# Altium schematic sheet SheetPower.SchDoc
size A4; DocumentNumber: 2; SheetNumber: 2; SheetTotal: 5
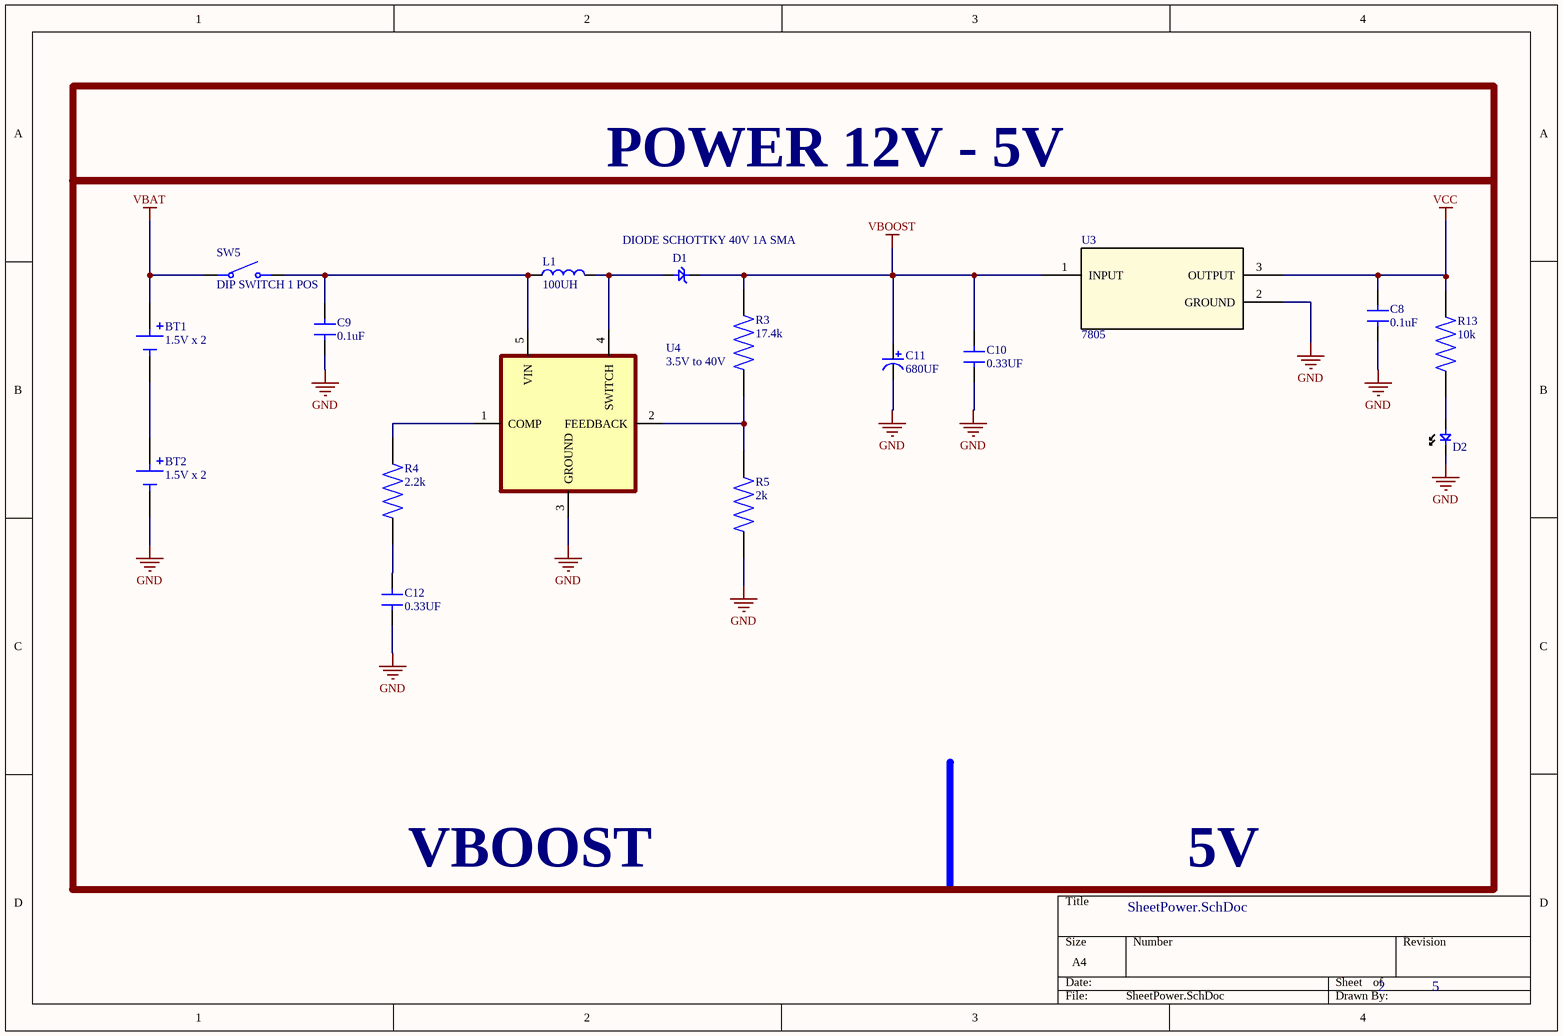
[diagram p0: SheetPower.SchDoc]

## Parts
BT1  1.5V x 2  [AAA battery holder]
BT2  1.5V x 2  [AAA battery holder]
C8  0.1uF  [CAP104 0.1UF 50V]
C9  0.1uF  [CAP104 0.1UF 50V]
C10  0.33UF  [CAP 0.33UF]
C11  680UF  [680uf 35v]
C12  0.33UF  [CAP 0.33UF]
D1  DIODE SCHOTTKY 40V 1A SMA  [DIODE SCHOTTKY 40V 1A SMA]
D2  LED SM 0805 2V 100MCD RED  [LED 0805]  (value not drawn)
L1  100UH  [FIXED IND 100UH 2.5A 135MOHM SMD]
R3  17.4k  [RESC2012X60N]
R4  2.2k  [RESC2012X60N]
R5  2k  [RESC2012X60N]
R13  10k  [RC0805 10K OHM 1% 1/8W]
SW5  DIP SWITCH 1 POS  [DIP SWITCH 1 POS]
U3  7805  [DPAK-3_ONS-M]
U4  3.5V to 40V  [LM2577S-ADJ]

## Nets
GND: BT2.2 C8.1 C9.1 C10.1 C11.2 C12.1 D2.K R5.1 U3.2(GROUND) U4.3(GROUND)
VBAT: BT1.1 SW5.1
VBOOST: C10.2 C11.1 D1.2 R3.2 U3.1(INPUT)
VCC: C8.2 R13.2 U3.3(OUTPUT)
NetBT1_2: BT1.2 BT2.1
NetC9_2: C9.2 L1.1 SW5.2 U4.5(VIN)
NetC12_2: C12.2 R4.1
NetD1_1: D1.1 L1.2 U4.4(SWITCH)
NetD2_A: D2.A R13.1
NetR3_1: R3.1 R5.2 U4.2(FEEDBACK)
NetR4_2: R4.2 U4.1(COMP)

## Notes on the sheet
- POWER 12V - 5V
- VBOOST
- 5V

## Library data of the parts
BT1 BT2 = BC2AAAL: 2 AAA Battery Holder; Package: None; Price: None; Value: *; MP: BC2AAAL; Availability: Unavailable
C8 C9 = C0805C104K5RACTU: Cap Ceramic 0.1uF 50V X7R 10% SMD 2.0 x 1.2 mm 125 C Paper T/R; Manufacturer: KEMET; Capacitance: 100nF; Voltage: 500V; Supplier 1: Digi-Key; Manufacturer Part Number: C0805C104K5RACTU; Stock 1: 2487008; Pricing 1: 1 = 0.16000, 10 = 0.11500, 50 = 0.06540, 100 = 0.05420, 500 = 0.03802, 1000 = 0.03147 (USD); RoHS: Yes; Mount: Surface Mount,PCB; Case/Package: 0805; Number of Pins: 2; Dielectric Material: Ceramic; Case Code (Imperial): 0805; Case Code (Metric): 2012; Contact Plating: Tin,Matte; Min Operating Temperature: -55°C; Max Operating Temperature: 125°C; Tolerance: 10%; Packaging: Tape and Reel; Voltage Rating (DC): 50V; Dielectric: X7R; Termination: SMD/SMT; Package Quantity: 4000; Voltage Rating: 50V; Length: 2mm; Height: 0.9mm; Width: 1.2mm; Lead Pitch: 0.75mm; Depth: 1.25mm; Thickness: 0.035inch; Radiation Hardening: No; REACH SVHC: No SVHC; ComponentLink1URL: https://datasheet.ciiva.com/14589/70095383-14589048.pdf?src-supplier=Allied+Electronics; ComponentLink1Description: https://datasheet.ciiva.com/14589/70095383-14589048.pdf?src-supplier=Allied+Electronics; ComponentLink2URL: https://datasheet.ciiva.com/28682/1851736-28682232.pdf?src-supplier=Element14; ComponentLink2Description: https://datasheet.ciiva.com/28682/1851736-28682232.pdf?src-supplier=Element14; ComponentLink3URL: https://datasheet.ciiva.com/32431/slceramic-chip-condensers-e-32431755.pdf?src-supplier=Distrelec; ComponentLink3Description: https://datasheet.ciiva.com/32431/slceramic-chip-condensers-e-32431755.pdf?src-supplier=Distrelec; ComponentLink4URL: https://datasheet.ciiva.com/18410/70095383-18410815.pdf?src-supplier=Allied+Electronics; ComponentLink4Description: https://datasheet.ciiva.com/18410/70095383-18410815.pdf?src-supplier=Allied+Electronics; Supplier Part Number 1: 399-1170-1-ND
C10 C12 = C0805C334M4VACTU: Multilayer Ceramic Capacitors MLCC - SMD/SMT 16volts 0.33uF Y5V 20%; Manufacturer: KEMET; Capacitance: 330nF; Voltage Rating: 16V; Dissipation Factor: 7%; Supplier 1: Digi-Key; Manufacturer Part Number: C0805C334M4VACTU; Stock 1: 0; Pricing 1: 5000 = 0.06512 (USD); RoHS: Yes; Mount: Surface Mount; Case/Package: 0805; Case Code (Metric): 2012; Case Code (Imperial): 0805; Dielectric Material: Ceramic; Min Operating Temperature: -30°C; Max Operating Temperature: 85°C; Tolerance: 20%; Package Quantity: 4000; Packaging: Tape and Reel; Voltage Rating (DC): 16V; Dielectric: Y5V; Termination: SMD/SMT; Resistor Type: Ceramic; Series: C; Construction: Flat; Length: 2mm; Width: 0.049inch; Height: 0.78mm; Thickness: 0.043inch; Lead Pitch: 0.75mm; Depth: 1.25mm; Lead Free: Lead Free; RoHS Compliant: Yes; ComponentLink1URL: http://www.mouser.com/ds/2/212/KEM_C1005_Y5V_SMD-1101305.pdf?src-supplier=Mouser; ComponentLink1Description: http://www.mouser.com/ds/2/212/KEM_C1005_Y5V_SMD-1101305.pdf?src-supplier=Mouser; ComponentLink2URL: https://search.kemet.com/component-edge/download/datasheet/C0805C334M4VACTU.pdf?src-supplier=Digi-Key; ComponentLink2Description: https://search.kemet.com/component-edge/download/datasheet/C0805C334M4VACTU.pdf?src-supplier=Digi-Key; Supplier Part Number 1: C0805C334M4VACTU-ND
C11 = UCX1V681MNS1MS: Cap Alum 680UF 20% 35V SMD; Manufacturer: Nichicon; ESR (Equivalent Series Resistance): 70mR; Ripple Current: 750mA; Life (Hours): 2000Hour; Supplier 1: Digi-Key; Manufacturer Part Number: UCX1V681MNS1MS; Stock 1: 23; Pricing 1: 1 = 2.25000, 10 = 1.81900, 50 = 1.58760, 100 = 1.38910 (USD); RoHS: Yes; Mount: Surface Mount; Case/Package: Radial; Min Operating Temperature: -40°C; Max Operating Temperature: 135°C; Package Quantity: 1; Packaging: Tape and Reel; Capacitance: 680uF; Tolerance: 20%; Voltage Rating: 35V; Height - Seated (Max): 0.551inch; RoHS Compliant: Yes; ComponentLink1URL: https://datasheet.ciiva.com/29546/e-cx-29546213.pdf?src-supplier=Digi-Key; ComponentLink1Description: https://datasheet.ciiva.com/29546/e-cx-29546213.pdf?src-supplier=Digi-Key; ComponentLink2URL: https://datasheet.ciiva.com/29546/e-cx-29546214.pdf?src-supplier=Digi-Key; ComponentLink2Description: https://datasheet.ciiva.com/29546/e-cx-29546214.pdf?src-supplier=Digi-Key; Supplier Part Number 1: 493-13600-1-ND
D1 = SS14: ON SEMICONDUCTOR - SS14 - DIODE, SCHOTTKY, 1A, 40V, DO-214AC-2; Manufacturer: ON Semiconductor / Fairchild; Forward Voltage: 500mV; Element Configuration: Single; Max Reverse Current: 200uA; Max Forward Surge Current (Ifsm): 40A; Number of Elements: 1; Max Power Dissipation: 1.1W; Polarity: Standard; Supplier 1: Digi-Key; Manufacturer Part Number: SS14; Stock 1: 173670; Pricing 1: 1 = 0.37000, 10 = 0.25900, 100 = 0.13820, 500 = 0.07920, 1000 = 0.05760, 2000 = 0.05472 (USD); RoHS: Yes; Mount: Surface Mount; Case/Package: SMA; Number of Pins: 2; Weight: 0.003739oz; Number of Terminals: 2; Min Operating Temperature: -65°C; Max Operating Temperature: 125°C; Forward Current: 1A; Max Repetitive Reverse Voltage (Vrrm): 40V; Peak Non-Repetitive Surge Current: 40A; Current Rating: 1A; Current: 1A; Voltage: 40V; Packaging: Tape and Reel; Package Quantity: 7500; Average Rectified Current: 1A; Termination: SMD/SMT; Power Dissipation: 1.1W; Voltage Rating (DC): 40V; Output Current: 1A; Max Reverse Voltage (DC): 40V; Length: 4.75mm; Height: 2.2mm; Width: 2.95mm; Radiation Hardening: No; REACH SVHC: No SVHC; Lead Free: Lead Free; ComponentLink1URL: https://datasheet.ciiva.com/4713/ss14-197224-4713938.pdf?src-supplier=Mouser; ComponentLink1Description: https://datasheet.ciiva.com/4713/ss14-197224-4713938.pdf?src-supplier=Mouser; ComponentLink2URL: https://datasheet.ciiva.com/8303/ss19-8303766.pdf?src-supplier=Avnet; ComponentLink2Description: https://datasheet.ciiva.com/8303/ss19-8303766.pdf?src-supplier=Avnet; ComponentLink3URL: https://datasheet.ciiva.com/910/ss12-910695.pdf?src-supplier=Digi-Key; ComponentLink3Description: https://datasheet.ciiva.com/910/ss12-910695.pdf?src-supplier=Digi-Key; ComponentLink4URL: https://datasheet.ciiva.com/910/ss12-910696.pdf?src-supplier=Digi-Key; ComponentLink4Description: https://datasheet.ciiva.com/910/ss12-910696.pdf?src-supplier=Digi-Key; ComponentLink5URL: https://datasheet.ciiva.com/25951/ss19-25951496.pdf?src-supplier=Avnet+Europe; ComponentLink5Description: https://datasheet.ciiva.com/25951/ss19-25951496.pdf?src-supplier=Avnet+Europe; ComponentLink6URL: https://datasheet.ciiva.com/910/ss12-910697.pdf?src-supplier=Digi-Key; ComponentLink6Description: https://datasheet.ciiva.com/910/ss12-910697.pdf?src-supplier=Digi-Key; ComponentLink7URL: https://datasheet.ciiva.com/7965/1766303-7965241.pdf?src-supplier=Element14; ComponentLink7Description: https://datasheet.ciiva.com/7965/1766303-7965241.pdf?src-supplier=Element14; ComponentLink8URL: https://datasheet.ciiva.com/22651/1880990-22651980.pdf?src-supplier=Element14; ComponentLink8Description: https://datasheet.ciiva.com/22651/1880990-22651980.pdf?src-supplier=Element14; Supplier Part Number 1: SS14CT-ND
D2 = LSM0805412V: Red 625nm LED Indication - Discrete 2V 0805 (2012 Metric); Manufacturer: Visual Communications; Supplier 1: Digi-Key; Manufacturer Part Number: LSM0805412V; Stock 1: 1900; Pricing 1: 1 = 0.47000, 10 = 0.34000, 100 = 0.15120, 500 = 0.10584, 1000 = 0.08694 (USD); RoHS: No; Supplier Part Number 1: 28-LSM0805412VCT-ND
L1 = SRR1210A-101M: SMD Shieled Power Inductor;  100uH;  20%; SRR1210A; Manufacturer: Bourns; Core Material: Ferrite; Current Rating: 2.5A; Saturation Current: 2.2A; Shielding: Shielded; DC Resistance (DCR): 135mR; Self Resonant Frequency: 3MHz; Test Frequency: 1kHz; Supplier 1: Digi-Key; Manufacturer Part Number: SRR1210A-101M; Stock 1: 736; Pricing 1: 1 = 1.37000, 10 = 1.26800, 25 = 1.17000, 50 = 0.97500, 100 = 0.91650 (USD); RoHS: Yes; Mount: Surface Mount; Case/Package: Nonstandard; Min Operating Temperature: -40°C; Max Operating Temperature: 125°C; Inductance Tolerance: 20%; Packaging: Tape and Reel; Tolerance: 20%; Inductance: 100uH; RMS Current (Irms): 2.5A; Termination: SMD/SMT; Length: 0.472inch; Width: 0.472inch; Height - Seated (Max): 0.394inch; Ratings: AEC-Q200; REACH SVHC: No SVHC; ComponentLink1URL: https://datasheet.ciiva.com/46451/1865601-46451002.pdf?src-supplier=Element14; ComponentLink1Description: https://datasheet.ciiva.com/46451/1865601-46451002.pdf?src-supplier=Element14; ComponentLink2URL: https://datasheet.ciiva.com/48954/70480994-48954492.pdf?src-supplier=Allied+Electronics; ComponentLink2Description: https://datasheet.ciiva.com/48954/70480994-48954492.pdf?src-supplier=Allied+Electronics; Supplier Part Number 1: SRR1210A-101MCT-ND
R3 = RC0805FR-0717K4L: Resistor;Resistance:17K4ohm;Resistance Tolerance:± 1%;Resistor Element Material:Thick Film;Resistor Case Style:0805; Manufacturer: Yageo; Resistance: 17.4kR; Power Rating: 125mW; Voltage Rating: 150V; Temperature Coefficient: 100ppm/°C; Supplier 1: Digi-Key; Manufacturer Part Number: RC0805FR-0717K4L; Stock 1: 127147; Pricing 1: 1 = 0.10000, 10 = 0.04200, 100 = 0.01690, 1000 = 0.00759, 2500 = 0.00659 (USD); RoHS: Yes; Case/Package: 0805; Case Code (Metric): 2012; Case Code (Imperial): 0805; Contact Plating: Tin,Lead,Matte; Size Code: 0805; Min Operating Temperature: -55°C; Max Operating Temperature: 155°C; Tolerance: 1%; Packaging: Tape and Reel; Package Quantity: 1; Resistor Type: Thick Film; Number of Terminations: 2; Termination: SMD/SMT; Max Power Dissipation: 125mW; Voltage Rating (DC): 150V; Features: Moisture Resistant; Series: RC; Construction: Rectangular; Length: 0.079inch; Width: 0.049inch; Height: 0.024inch; Depth: 1.25mm; Radiation Hardening: No; Military Standard: Not; Lead Free: Lead Free; RoHS Compliant: Yes; ComponentLink1URL: https://datasheet.ciiva.com/2457/pyu-r-int-thick-7-2457377.pdf?src-supplier=Digi-Key; ComponentLink1Description: https://datasheet.ciiva.com/2457/pyu-r-int-thick-7-2457377.pdf?src-supplier=Digi-Key; ComponentLink2URL: https://datasheet.ciiva.com/2457/pyu-r-int-thick-7-2457378.pdf?src-supplier=Digi-Key; ComponentLink2Description: https://datasheet.ciiva.com/2457/pyu-r-int-thick-7-2457378.pdf?src-supplier=Digi-Key; ComponentLink3URL: https://datasheet.ciiva.com/2457/pyu-r-int-thick-7-2457379.pdf?src-supplier=Digi-Key; ComponentLink3Description: https://datasheet.ciiva.com/2457/pyu-r-int-thick-7-2457379.pdf?src-supplier=Digi-Key; Supplier Part Number 1: 311-17.4KCRCT-ND
R4 = RC0805JR-072K2L: Res Thick Film 0805 2.2K Ohm 5% 0.125W(1/8W) ±100ppm/C Epoxy Pad SMD T/R; Manufacturer: Yageo; Resistance: 2.2kR; Power Rating: 125mW; Voltage Rating: 150V; Temperature Coefficient: 100ppm/°C; Supplier 1: Digi-Key; Manufacturer Part Number: RC0805JR-072K2L; Stock 1: 214583; Pricing 1: 1 = 0.10000, 10 = 0.03600, 100 = 0.01450, 1000 = 0.00652, 2500 = 0.00566 (USD); RoHS: Yes; Case/Package: 0805; Case Code (Imperial): 0805; Case Code (Metric): 2012; Contact Plating: Tin,Lead,Matte; Size Code: 0805; Min Operating Temperature: -55°C; Max Operating Temperature: 155°C; Tolerance: 5%; Packaging: Tape and Reel; Termination: SMD/SMT; Resistor Type: Thick Film; Features: Moisture Resistant; Series: RC; Max Power Dissipation: 125mW; Number of Terminations: 2; Construction: Rectangular; Resistance Tolerance: 5%; Length: 2mm; Depth: 1.25mm; Radiation Hardening: No; REACH SVHC: Unknown; Military Standard: Not; Lead Free: Lead Free; RoHS Compliant: Yes; ComponentLink1URL: https://datasheet.ciiva.com/12667/rc0805-12667397.pdf?src-supplier=Mouser; ComponentLink1Description: https://datasheet.ciiva.com/12667/rc0805-12667397.pdf?src-supplier=Mouser; ComponentLink2URL: https://datasheet.ciiva.com/15190/getdatasheetpartid-251869-15190044.pdf?src-supplier=Verical; ComponentLink2Description: https://datasheet.ciiva.com/15190/getdatasheetpartid-251869-15190044.pdf?src-supplier=Verical; ComponentLink3URL: https://datasheet.ciiva.com/7941/442941-7941935.pdf?src-supplier=Element14; ComponentLink3Description: https://datasheet.ciiva.com/7941/442941-7941935.pdf?src-supplier=Element14; Supplier Part Number 1: 311-2.2KARCT-ND
R5 = RC0805FR-072KL: Res Thick Film 2.0 x 1.2 mm 2K Ohm 1% 0.125W(1/8W) 100ppm/ C Molded SMD Paper T/R; Manufacturer: Yageo; Resistance: 2kR; Temperature Coefficient: 100ppm/°C; Voltage Rating (DC): 150V; Power Rating: 125mW; Supplier 1: Digi-Key; Manufacturer Part Number: RC0805FR-072KL; Stock 1: 1229948; Pricing 1: 1 = 0.10000, 10 = 0.04200, 100 = 0.01690, 1000 = 0.00759, 2500 = 0.00659 (USD); RoHS: Yes; Case/Package: 0805; Number of Pins: 2; Case Code (Metric): 2012; Case Code (Imperial): 0805; Min Operating Temperature: -55°C; Max Operating Temperature: 155°C; Tolerance: 1%; Packaging: Tape and Reel; Resistor Type: Thick Film; Voltage Rating: 150V; Number of Terminations: 2; Termination: SMD/SMT; Max Power Dissipation: 125mW; Features: Moisture Resistant; Series: RC; Resistance Tolerance: 1%; Construction: Rectangular; Working Voltage: 150V; Technology: THICK FILM; Package Quantity: 1; Length: 2mm; Width: 0.049inch; Height: 0.024inch; Depth: 1.25mm; Lead Free: Lead Free; REACH SVHC: No SVHC; Military Standard: Not; RoHS Compliant: Yes; ComponentLink1URL: https://datasheet.ciiva.com/11819/0900766b8106beab-11819830.pdf?src-supplier=RSComponents; ComponentLink1Description: https://datasheet.ciiva.com/11819/0900766b8106beab-11819830.pdf?src-supplier=RSComponents; ComponentLink2URL: https://datasheet.ciiva.com/2457/pyu-r-int-thick-7-2457027.pdf?src-supplier=Digi-Key; ComponentLink2Description: https://datasheet.ciiva.com/2457/pyu-r-int-thick-7-2457027.pdf?src-supplier=Digi-Key; ComponentLink3URL: https://datasheet.ciiva.com/12667/rc0805-12667946.pdf?src-supplier=Mouser; ComponentLink3Description: https://datasheet.ciiva.com/12667/rc0805-12667946.pdf?src-supplier=Mouser; ComponentLink4URL: https://datasheet.ciiva.com/2457/pyu-r-int-thick-7-2457026.pdf?src-supplier=Digi-Key; ComponentLink4Description: https://datasheet.ciiva.com/2457/pyu-r-int-thick-7-2457026.pdf?src-supplier=Digi-Key; ComponentLink5URL: https://datasheet.ciiva.com/2457/pyu-r-int-thick-7-2457028.pdf?src-supplier=Digi-Key; ComponentLink5Description: https://datasheet.ciiva.com/2457/pyu-r-int-thick-7-2457028.pdf?src-supplier=Digi-Key; ComponentLink6URL: https://datasheet.ciiva.com/46395/444164-46395128.pdf?src-supplier=Element14; ComponentLink6Description: https://datasheet.ciiva.com/46395/444164-46395128.pdf?src-supplier=Element14; Supplier Part Number 1: 311-2.00KCRCT-ND
R13 = RC0805FR-0710KL: RES SMD 10K OHM 1% 1/8W 0805; Manufacturer: Yageo; Resistance: 10kR; Temperature Coefficient: 100ppm/°C; Power Rating: 125mW; Voltage Rating: 150V; Supplier 1: Digi-Key; Manufacturer Part Number: RC0805FR-0710KL; Stock 1: 18880636; Pricing 1: 1 = 0.10000, 10 = 0.03900, 100 = 0.01570, 1000 = 0.00705, 2500 = 0.00612 (USD); RoHS: Yes; Case/Package: 0805; Case Code (Imperial): 0805; Case Code (Metric): 2012; Min Operating Temperature: -55°C; Max Operating Temperature: 155°C; Packaging: Tape and Reel; Tolerance: 1%; Composition: Thick Film; Package Quantity: 1; Termination: SMD/SMT; Number of Terminations: 2; Military Standard: Not; Max Power Dissipation: 125mW; Features: Moisture Resistant; Length: 2mm; Height: 0.024inch; Width: 0.049inch; Depth: 1.25mm; REACH SVHC: Unknown; Lead Free: Lead Free; ComponentLink1URL: https://datasheet.ciiva.com/11808/0900766b8106beab-11808151.pdf?src-supplier=RSComponents; ComponentLink1Description: https://datasheet.ciiva.com/11808/0900766b8106beab-11808151.pdf?src-supplier=RSComponents; ComponentLink2URL: https://datasheet.ciiva.com/12669/rc0805-12669688.pdf?src-supplier=Mouser; ComponentLink2Description: https://datasheet.ciiva.com/12669/rc0805-12669688.pdf?src-supplier=Mouser; ComponentLink3URL: https://datasheet.ciiva.com/46447/444164-46447563.pdf?src-supplier=Element14; ComponentLink3Description: https://datasheet.ciiva.com/46447/444164-46447563.pdf?src-supplier=Element14; ComponentLink4URL: https://datasheet.ciiva.com/2456/pyu-r-int-thick-7-2456972.pdf?src-supplier=Digi-Key; ComponentLink4Description: https://datasheet.ciiva.com/2456/pyu-r-int-thick-7-2456972.pdf?src-supplier=Digi-Key; ComponentLink5URL: https://datasheet.ciiva.com/2456/pyu-r-int-thick-7-2456973.pdf?src-supplier=Digi-Key; ComponentLink5Description: https://datasheet.ciiva.com/2456/pyu-r-int-thick-7-2456973.pdf?src-supplier=Digi-Key; ComponentLink6URL: https://datasheet.ciiva.com/2456/pyu-r-int-thick-7-2456974.pdf?src-supplier=Digi-Key; ComponentLink6Description: https://datasheet.ciiva.com/2456/pyu-r-int-thick-7-2456974.pdf?src-supplier=Digi-Key; ComponentLink7URL: https://datasheet.ciiva.com/16747/rc0805-16747087.pdf?src-supplier=Future+Electronics; ComponentLink7Description: https://datasheet.ciiva.com/16747/rc0805-16747087.pdf?src-supplier=Future+Electronics; Supplier Part Number 1: 311-10.0KCRCT-ND
SW5 = KG01ET: Manufacturer: CIT Relay & Switch; Supplier 1: Digi-Key; Manufacturer Part Number: KG01ET; Stock 1: 0; Pricing 1: 1 = 0.36000, 10 = 0.35100, 25 = 0.33080, 100 = 0.28720, 250 = 0.26056, 500 = 0.24240, 1000 = 0.21816, 2500 = 0.20483, 5000 = 0.19028 (USD); RoHS: No; Supplier Part Number 1: 2449-KG01ET-ND
U3 = MC78M05CDTRKG: Standard Regulator Pos 5V 0.5A 3-Pin(2+Tab) DPAK T/R; Manufacturer: ON Semiconductor; Dropout Voltage: 2V; Number of Outputs: 1; Output Current: 500mA; Max Input Voltage: 35V; Min Input Voltage: 7V; Polarity: Positive; Power Supply Rejection Ratio (PSRR): 80dB; Input Bias Current: 3.2mA; Output Type: Fixed; Supplier 1: Digi-Key; Manufacturer Part Number: MC78M05CDTRKG; Stock 1: 64996; Pricing 1: 1 = 0.45000, 10 = 0.38500, 25 = 0.35960, 100 = 0.28760, 250 = 0.26704, 500 = 0.22598, 1000 = 0.17461 (USD); RoHS: Yes; Mount: Surface Mount; Case/Package: DPAK; Number of Pins: 3; Contact Plating: Tin,Matte; Min Operating Temperature: 0°C; Max Operating Temperature: 125°C; Max Output Current: 500mA; Output Voltage: 5V; Packaging: Tape and Reel; Package Quantity: 1; Nominal Output Voltage: 5V; Number of Regulators: 1; Min Output Voltage: 5V; Current Rating: 500mA; Operating Supply Voltage: 35V; Series: -; Length: 0.264inch; Width: 0.295inch; Height: 0.094inch; Radiation Hardening: No; REACH SVHC: No SVHC; Lead Free: Lead Free; Halogen Free: Halogen Free; RoHS Compliant: Yes; ComponentLink1URL: https://datasheet.ciiva.com/15111/getdatasheetpartid-110408-15111739.pdf?src-supplier=Verical; ComponentLink1Description: https://datasheet.ciiva.com/15111/getdatasheetpartid-110408-15111739.pdf?src-supplier=Verical; ComponentLink2URL: https://datasheet.ciiva.com/2042/mc78m00-d-2042083.pdf?src-supplier=Digi-Key; ComponentLink2Description: https://datasheet.ciiva.com/2042/mc78m00-d-2042083.pdf?src-supplier=Digi-Key; ComponentLink3URL: https://datasheet.ciiva.com/2042/mc78m00-d-2042084.pdf?src-supplier=Digi-Key; ComponentLink3Description: https://datasheet.ciiva.com/2042/mc78m00-d-2042084.pdf?src-supplier=Digi-Key; ComponentLink4URL: https://datasheet.ciiva.com/2042/mc78m00-d-2042085.pdf?src-supplier=Digi-Key; ComponentLink4Description: https://datasheet.ciiva.com/2042/mc78m00-d-2042085.pdf?src-supplier=Digi-Key; ComponentLink5URL: https://datasheet.ciiva.com/8234/mc78m00-d-8234184.pdf?src-supplier=Avnet; ComponentLink5Description: https://datasheet.ciiva.com/8234/mc78m00-d-8234184.pdf?src-supplier=Avnet; ComponentLink6URL: https://datasheet.ciiva.com/14562/70099623-14562024.pdf?src-supplier=Allied+Electronics; ComponentLink6Description: https://datasheet.ciiva.com/14562/70099623-14562024.pdf?src-supplier=Allied+Electronics; ComponentLink7URL: https://datasheet.ciiva.com/16449/mc78m00-d-16449183.pdf?src-supplier=Future+Electronics; ComponentLink7Description: https://datasheet.ciiva.com/16449/mc78m00-d-16449183.pdf?src-supplier=Future+Electronics; ComponentLink8URL: https://datasheet.ciiva.com/25979/mc78m00-d-25979871.pdf?src-supplier=Avnet+Europe; ComponentLink8Description: https://datasheet.ciiva.com/25979/mc78m00-d-25979871.pdf?src-supplier=Avnet+Europe; Supplier Part Number 1: MC78M05CDTRKGOSCT-ND
U4 = LM2577S-ADJ/NOPB: Converter DC-DC Single Step Up 3.5V to 40V 6-Pin (5+Tab) TO-263 Rail; Manufacturer: TI National Semiconductor; Max Output Current: 3A; Output Voltage: 15V; Number of Outputs: 1; Efficiency: 80%; Switching Frequency: 52kHz; Min Output Voltage: 1.23V; Quiescent Current: 10mA; Topology: Boost,Flyback; Output Type: Adjustable; Manufacturer Part Number: LM2577S-ADJ/NOPB; Stock 1: 1571; Pricing 1: 1 = 8.70000, 10 = 7.86000, 25 = 7.49480, 100 = 6.50760, 250 = 6.21508, 500 = 5.66670, 1000 = 5.17350 (USD); RoHS: Yes; Mount: Surface Mount; Case/Package: TO-263; Number of Pins: 5; Weight: 0.056128oz; Contact Plating: Tin,Matte; Min Operating Temperature: -40°C; Max Operating Temperature: 125°C; Max Input Voltage: 40V; Min Supply Voltage: 3.5V; Output Current: 3A; Packaging: Cut Tape; Min Input Voltage: 3.5V; Max Output Voltage: 15V; Operating Supply Voltage: 40V; Length: 10.41mm; Width: 10.16mm; Height: 4.65mm; Radiation Hardening: No; REACH SVHC: No SVHC; Lead Free: Contains Lead; RoHS Compliant: Yes; ComponentLink1URL: https://datasheet.ciiva.com/14150/jglm2577-datasheet-en-14150746.pdf?src-supplier=Distrelec; ComponentLink1Description: https://datasheet.ciiva.com/14150/jglm2577-datasheet-en-14150746.pdf?src-supplier=Distrelec; ComponentLink2URL: https://datasheet.ciiva.com/6596/lm1577-6596039.pdf?src-supplier=Digi-Key; ComponentLink2Description: https://datasheet.ciiva.com/6596/lm1577-6596039.pdf?src-supplier=Digi-Key; ComponentLink3URL: https://datasheet.ciiva.com/22669/1902747-22669445.pdf?src-supplier=Element14; ComponentLink3Description: https://datasheet.ciiva.com/22669/1902747-22669445.pdf?src-supplier=Element14; Supplier 1: Digi-Key; Supplier Part Number 1: LM2577S-ADJ/NOPB-ND